# EAGLE schematic T61 (EAGLE 9.6.2)
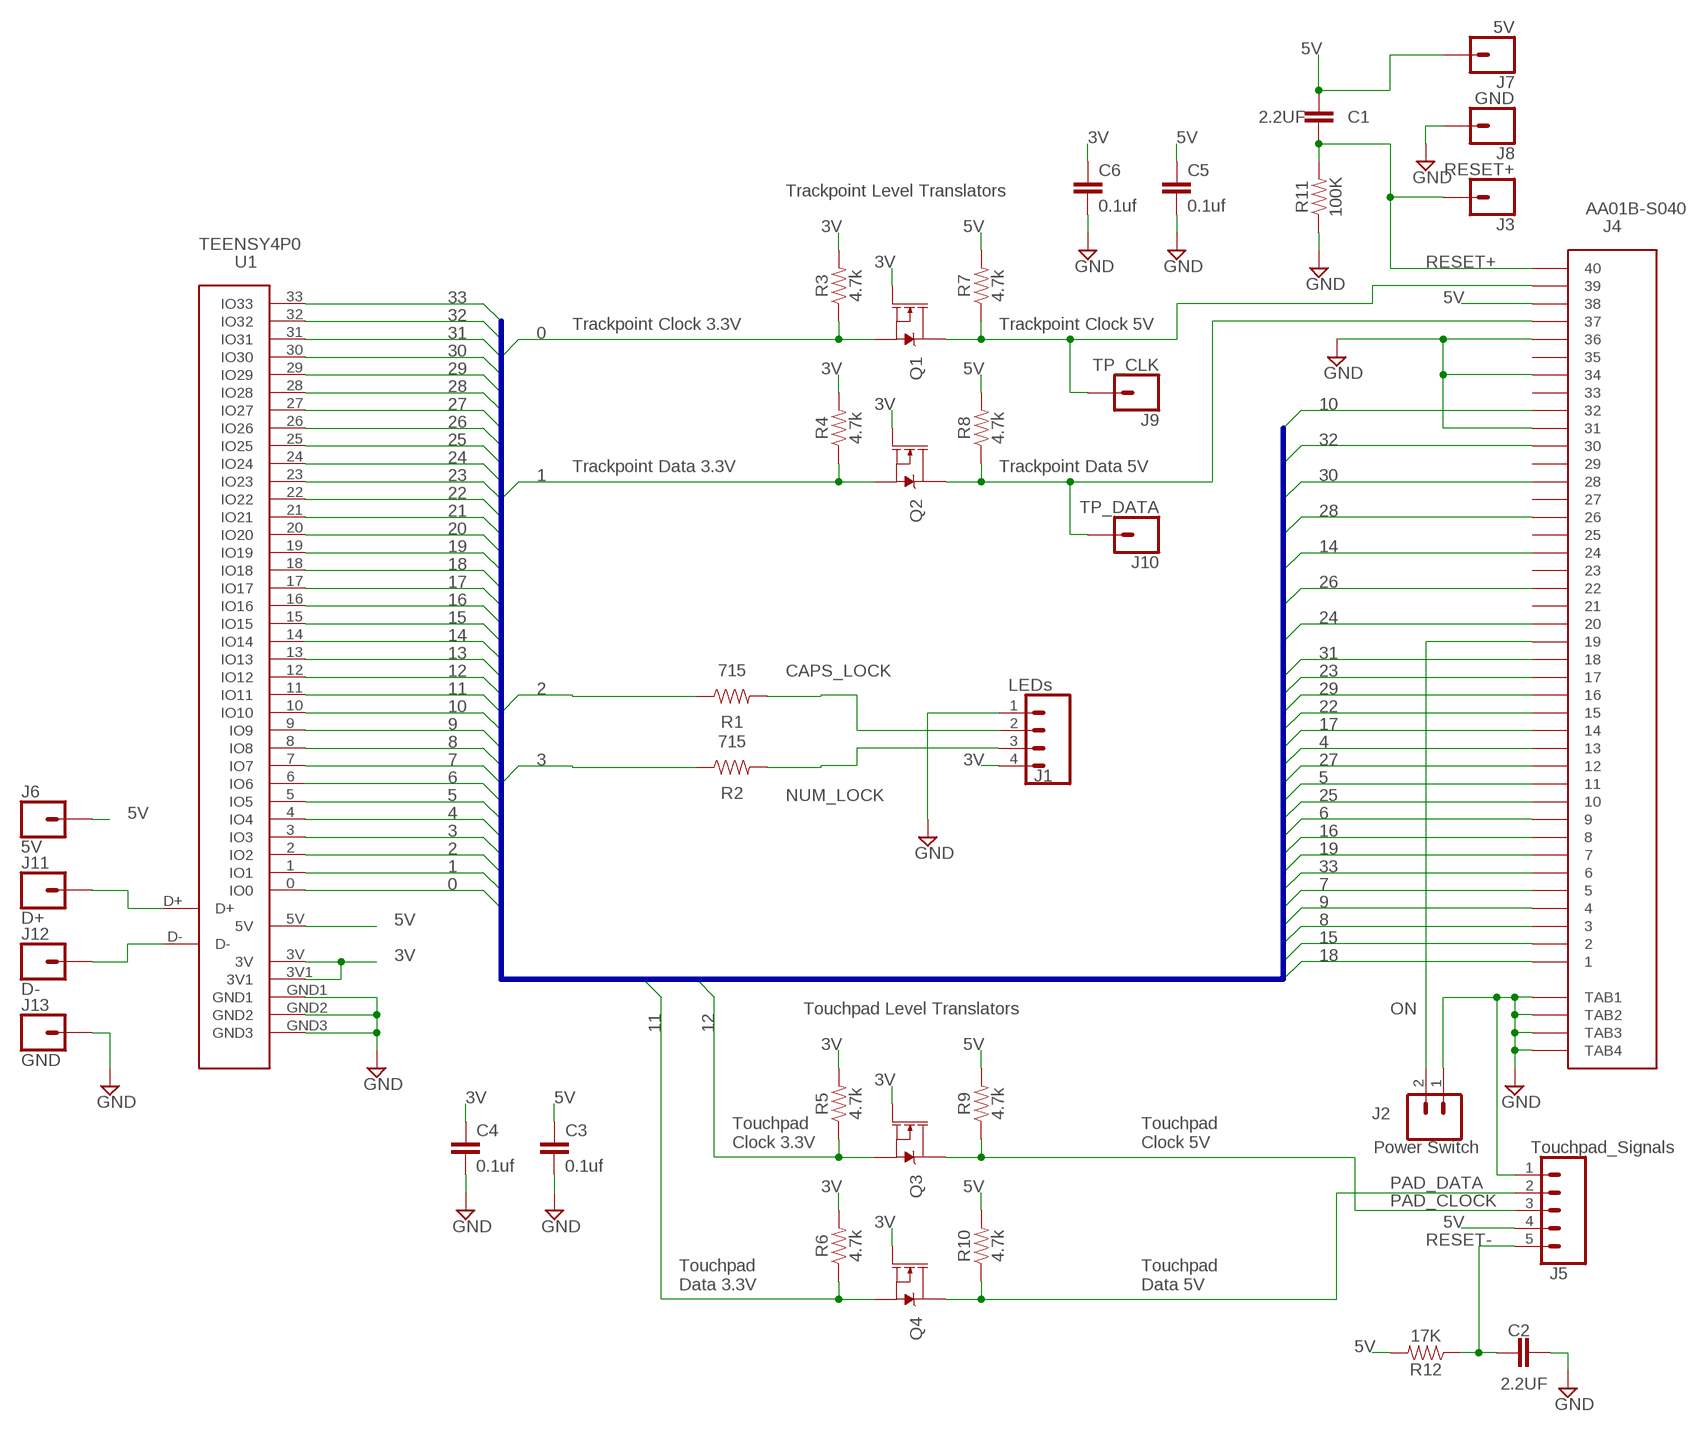
[diagram p0: schematic, sheet 1]

## Parts
C1  2.2UF  0603_CAP  [0603_CAP]
C2  2.2UF  0603_CAP  [0603_CAP]
C3  0.1uf  0603_CAP  [0603_CAP]
C4  0.1uf  0603_CAP  [0603_CAP]
C5  0.1uf  0603_CAP  [0603_CAP]
C6  0.1uf  0603_CAP  [0603_CAP]
J1  LEDs  CONN_04  [1X04]
J2  Power Switch  CONN_02  [1X02]
J3  RESET+  CONN_01PTH_NO_SILK_YES_STOP  [1X01_NO_SILK]
J4  AA01B-S040  WM6787_A01B  [WM6787_AA01B]
J5  Touchpad_Signals  CONN_05  [1X05]
J6  5V  CONN_01PTH_NO_SILK_YES_STOP  [1X01_NO_SILK]
J7  5V  CONN_01PTH_NO_SILK_YES_STOP  [1X01_NO_SILK]
J8  GND  CONN_01PTH_NO_SILK_YES_STOP  [1X01_NO_SILK]
J9  TP_CLK  CONN_01PTH_NO_SILK_YES_STOP  [1X01_NO_SILK]
J10  TP_DATA  CONN_01PTH_NO_SILK_YES_STOP  [1X01_NO_SILK]
J11  D+  CONN_01PTH_NO_SILK_YES_STOP  [1X01_NO_SILK]
J12  D-  CONN_01PTH_NO_SILK_YES_STOP  [1X01_NO_SILK]
J13  GND  CONN_01PTH_NO_SILK_YES_STOP  [1X01_NO_SILK]
Q1  220mA/50V/3.5Ω  MOSFET-NCH-BSS138  [SOT23-3]
Q2  220mA/50V/3.5Ω  MOSFET-NCH-BSS138  [SOT23-3]
Q3  220mA/50V/3.5Ω  MOSFET-NCH-BSS138  [SOT23-3]
Q4  220mA/50V/3.5Ω  MOSFET-NCH-BSS138  [SOT23-3]
R1  715  715OHM-0603-1/10W-1%  [0603]
R2  715  715OHM-0603-1/10W-1%  [0603]
R3  4.7k  4.7KOHM-0603-1/10W-1%  [0603]
R4  4.7k  4.7KOHM-0603-1/10W-1%  [0603]
R5  4.7k  4.7KOHM-0603-1/10W-1%  [0603]
R6  4.7k  4.7KOHM-0603-1/10W-1%  [0603]
R7  4.7k  4.7KOHM-0603-1/10W-1%  [0603]
R8  4.7k  4.7KOHM-0603-1/10W-1%  [0603]
R9  4.7k  4.7KOHM-0603-1/10W-1%  [0603]
R10  4.7k  4.7KOHM-0603-1/10W-1%  [0603]
R11  100K  0603_RESISTOR  [0603_RESISTOR]
R12  17K  0603_RESISTOR  [0603_RESISTOR]
U1  TEENSY4P0  [TEENSY4P0]

## Nets
0: Q1.2(S) R3.1 U1.0(IO0)
1: Q2.2(S) R4.1 U1.1(IO1)
2: R1.1 U1.2(IO2)
3: R2.1 U1.3(IO3)
3V: C4.1 C6.1 J1.4 Q1.1(G) Q2.1(G) Q3.1(G) Q4.1(G) R3.2 R4.2 R5.2 R6.2 U1.3V U1.3V1
4: J4.P$13 U1.4(IO4)
5: J4.P$11 U1.5(IO5)
5V: C1.1 C3.1 C5.1 J4.P$38 J5.4 J6.1 J7.1 R7.2 R8.2 R9.2 R10.2 R12.2 U1.5V
6: J4.P$9 U1.6(IO6)
7: J4.P$5 U1.7(IO7)
8: J4.P$3 U1.8(IO8)
9: J4.P$4 U1.9(IO9)
10: J4.P$32 U1.10(IO10)
11: Q4.2(S) R6.1 U1.11(IO11)
12: Q3.2(S) R5.1 U1.12(IO12)
13: U1.13(IO13)
14: J4.P$24 U1.14(IO14)
15: J4.P$2 U1.15(IO15)
16: J4.P$8 U1.16(IO16)
17: J4.P$14 U1.17(IO17)
18: J4.P$1 U1.18(IO18)
19: J4.P$7 U1.19(IO19)
20: U1.20(IO20)
21: U1.21(IO21)
22: J4.P$15 U1.22(IO22)
23: J4.P$17 U1.23(IO23)
24: J4.P$20 U1.24(IO24)
25: J4.P$10 U1.25(IO25)
26: J4.P$22 U1.26(IO26)
27: J4.P$12 U1.27(IO27)
28: J4.P$26 U1.28(IO28)
29: J4.P$16 U1.29(IO29)
30: J4.P$28 U1.30(IO30)
31: J4.P$18 U1.31(IO31)
32: J4.P$30 U1.32(IO32)
33: J4.P$6 U1.33(IO33)
CAPS_LOCK: J1.2 R1.2
D+: J11.1 U1.D+
D-: J12.1 U1.D-
GND: C2.2 C3.2 C4.2 C5.2 C6.2 J1.1 J2.1 J4.P$31 J4.P$34 J4.P$36 J4.TAB1 J4.TAB2 J4.TAB3 J4.TAB4 J5.1 J8.1 J13.1 R11.1 U1.GND1 U1.GND2 U1.GND3
NUM_LOCK: J1.3 R2.2
ON: J2.2 J4.P$19
PAD_CLOCK: J5.3 Q3.3(D) R9.1
PAD_DATA: J5.2 Q4.3(D) R10.1
RESET+: C1.2 J3.1 J4.P$40 R11.2
RESET-: C2.1 J5.5 R12.1
TP_CLK: J4.P$39 J9.1 Q1.3(D) R7.1
TP_DATA: J4.P$37 J10.1 Q2.3(D) R8.1
Unconnected: J4.P$21 J4.P$23 J4.P$25 J4.P$27 J4.P$29 J4.P$33 J4.P$35

## Buses
IO:0,1,2,3,4,5,6,7,8,9,10,11,12,13,14,15,16,17,18,19,20,21,22,23,24,25,26,27,28,29,30,31,32,33,TPCLK,TPDATA

## Notes on the sheet
- Trackpoint Level Translators
- Trackpoint Clock 3.3V | Trackpoint Clock 5V
- Trackpoint Data 3.3V | Trackpoint Data 5V
- Touchpad Level Translators
- Touchpad
  Clock 3.3V
- Touchpad
  Clock 5V
- Touchpad
  Data 3.3V
- Touchpad
  Data 5V

## Library data of the parts
C1-C6 = 0603_CAP:0603_CAP
J1 = SparkFun-Connectors:CONN_04: Multi connection point. Often used as Generic Header-pin footprint for 0.1 inch spaced/style header connections On any of the 0.1 inch spaced packages, you can populate with these: Break Away Headers - Straight <https://www.sparkfun.com/products/116> (PRT-00116) Break Away Male Headers - Right Angle <https://www.sparkfun.com/products/553> (PRT-00553) Female Headers <https://www.sparkfun.com/products/115> (PRT-00115) Break Away Headers - Machine Pin <https://www.sparkfun.com/products/117> (PRT-00117) Break Away Female Headers - Swiss Machine Pin <https://www.sparkfun.com/products/743> (PRT-00743) For SCREWTERMINALS and SPRING TERMINALS visit here: Screw Terimnals on SparkFun.com <https://www.sparkfun.com/search/results?term=Screw+Terminals> (5mm/3.5mm/2.54mm spacing) This device is also useful as a general connection point to wire up your design to another part of your project. Our various solder wires solder well into these plated through hole pads. Hook-Up Wire - Assortment (Stranded, 22 AWG) <https://www.sparkfun.com/products/11375> (PRT-11375) Hook-Up Wire - Assortment (Solid Core, 22 AWG) <https://www.sparkfun.com/products/11367> (PRT-11367) View the entire wire category on our website here <https://www.sparkfun.com/categories/141> Special notes: Molex polarized connector foot print use with SKU : PRT-08231 with associated crimp pins and housings. 1MM SMD Version SKU: PRT-10208; PROD_ID: CONN-09696
J2 = SparkFun-Connectors:CONN_02: Multi connection point. Often used as Generic Header-pin footprint for 0.1 inch spaced/style header connections On any of the 0.1 inch spaced packages, you can populate with these: Break Away Headers - Straight <https://www.sparkfun.com/products/116> (PRT-00116) Break Away Male Headers - Right Angle <https://www.sparkfun.com/products/553> (PRT-00553) Female Headers <https://www.sparkfun.com/products/115> (PRT-00115) Break Away Headers - Machine Pin <https://www.sparkfun.com/products/117> (PRT-00117) Break Away Female Headers - Swiss Machine Pin <https://www.sparkfun.com/products/743> (PRT-00743) For SCREWTERMINALS and SPRING TERMINALS visit here: Screw Terimnals on SparkFun.com <https://www.sparkfun.com/search/results?term=Screw+Terminals> (5mm/3.5mm/2.54mm spacing) This device is also useful as a general connection point to wire up your design to another part of your project. Our various solder wires solder well into these plated through hole pads. Hook-Up Wire - Assortment (Stranded, 22 AWG) <https://www.sparkfun.com/products/11375> (PRT-11375) Hook-Up Wire - Assortment (Solid Core, 22 AWG) <https://www.sparkfun.com/products/11367> (PRT-11367) View the entire wire category on our website here <https://www.sparkfun.com/categories/141> Special notes: Molex polarized connector foot print use with: PRT-08233 with associated crimp pins and housings. 2.54_SCREWTERM for use with PRT-10571. 3.5mm Screw Terminal footprints for PRT-08084 5mm Screw Terminal footprints for use with PRT-08432
J3 J6-J13 = SparkFun-Connectors:CONN_01: Single connection point. Often used as Generic Header-pin footprint for 0.1 inch spaced/style header connections On any of the 0.1 inch spaced packages, you can populate with these: Break Away Headers - Straight <https://www.sparkfun.com/products/116> (PRT-00116) Break Away Male Headers - Right Angle <https://www.sparkfun.com/products/553> (PRT-00553) Female Headers <https://www.sparkfun.com/products/115> (PRT-00115) Break Away Headers - Machine Pin <https://www.sparkfun.com/products/117> (PRT-00117) Break Away Female Headers - Swiss Machine Pin <https://www.sparkfun.com/products/743> (PRT-00743) This device is also useful as a general connection point to wire up your design to another part of your project. Our various solder wires solder well into these plated through hole pads. Hook-Up Wire - Assortment (Stranded, 22 AWG) <https://www.sparkfun.com/products/11375> (PRT-11375) Hook-Up Wire - Assortment (Solid Core, 22 AWG) <https://www.sparkfun.com/products/11367> (PRT-11367) View the entire wire category on our website here <https://www.sparkfun.com/categories/141> Special notes: SMTSO-256-ET is a "flush mount" nut for a 4-40 screw. We mostly use this on specialty testbeds; it is a nice way to connect hardware to your PCB at an adjustable hieght. Also note, the SNAP packages are for using a snappable style connector. We sell a baggie of snaps and they are also used on two LilyPad designs: Snap Assortment - 30 pack (male and female) <https://www.sparkfun.com/products/11347> (DEV-11347) LilyPad Arduino SimpleSnap <https://www.sparkfun.com/products/10941> (DEV-10941) LilyPad SimpleSnap Protoboard <https://www.sparkfun.com/products/10940> (DEV-10940)
J4 = WM6787_A01B:WM6787_A01B
J5 = SparkFun-Connectors:CONN_05: Multi connection point. Often used as Generic Header-pin footprint for 0.1 inch spaced/style header connections On any of the 0.1 inch spaced packages, you can populate with these: Break Away Headers - Straight <https://www.sparkfun.com/products/116> (PRT-00116) Break Away Male Headers - Right Angle <https://www.sparkfun.com/products/553> (PRT-00553) Female Headers <https://www.sparkfun.com/products/115> (PRT-00115) Break Away Headers - Machine Pin <https://www.sparkfun.com/products/117> (PRT-00117) Break Away Female Headers - Swiss Machine Pin <https://www.sparkfun.com/products/743> (PRT-00743) For SCREWTERMINALS and SPRING TERMINALS visit here: Screw Terimnals on SparkFun.com <https://www.sparkfun.com/search/results?term=Screw+Terminals> (5mm/3.5mm/2.54mm spacing) This device is also useful as a general connection point to wire up your design to another part of your project. Our various solder wires solder well into these plated through hole pads. Hook-Up Wire - Assortment (Stranded, 22 AWG) <https://www.sparkfun.com/products/11375> (PRT-11375) Hook-Up Wire - Assortment (Solid Core, 22 AWG) <https://www.sparkfun.com/products/11367> (PRT-11367) View the entire wire category on our website here <https://www.sparkfun.com/categories/141> Special notes: Molex polarized connector foot print use with SKU : PRT-08231 with associated crimp pins and housings. 1MM SMD Version SKU: PRT-10208
Q1-Q4 = SparkFun-DiscreteSemi:MOSFET-NCH: N-channel MOSFETs Voltage controlled devices that allow control of high current outputs. SparkFun Products: SparkFun OpenScale <https://www.sparkfun.com/products/13261> SparkFun Digital Sandbox <https://www.sparkfun.com/products/12651> SparkFun Monster Moto Shield <https://www.sparkfun.com/products/10182> SparkFun MOSFET Power Controller <https://www.sparkfun.com/products/11214>; PROD_ID: TRANS-00830
R1 R2 = SparkFun-Resistors:715OHM: 715Ω resistor A resistor is a passive two-terminal electrical component that implements electrical resistance as a circuit element. Resistors act to reduce current flow, and, at the same time, act to lower voltage levels within circuits. - Wikipedia; PROD_ID: RES-07850
R3-R10 = SparkFun-Resistors:4.7KOHM: 4.7kΩ resistor A resistor is a passive two-terminal electrical component that implements electrical resistance as a circuit element. Resistors act to reduce current flow, and, at the same time, act to lower voltage levels within circuits. - Wikipedia; PROD_ID: RES-07857
R11 R12 = 0603_RESISTOR:0603_RESISTOR
U1 = TEENSY4P0:TEENSY4P0